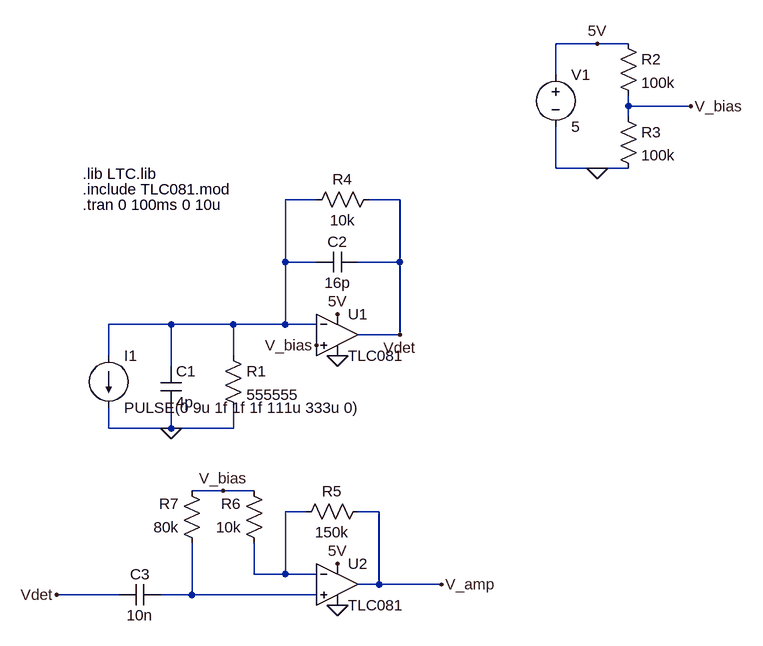
[diagram p0: schematic Draft1.asc]
Draft1.asc, the LTspice schematic file:
Version 4.1
SHEET 1 880 780
WIRE 640 -128 576 -128
WIRE 688 -128 640 -128
WIRE 576 -80 576 -128
WIRE 688 -32 688 -48
WIRE 784 -32 688 -32
WIRE 688 -16 688 -32
WIRE 576 64 576 0
WIRE 640 64 576 64
WIRE 688 64 640 64
WIRE 208 112 160 112
WIRE 336 112 288 112
WIRE 160 208 160 112
WIRE 208 208 160 208
WIRE 336 208 336 112
WIRE 336 208 272 208
WIRE -16 304 -112 304
WIRE 80 304 -16 304
WIRE 160 304 160 208
WIRE 160 304 80 304
WIRE 208 304 160 304
WIRE 336 320 336 208
WIRE 336 320 272 320
WIRE -112 352 -112 304
WIRE 80 352 80 304
WIRE -16 368 -16 304
WIRE -112 464 -112 432
WIRE -16 464 -16 432
WIRE -16 464 -112 464
WIRE 80 464 80 432
WIRE 80 464 -16 464
WIRE 64 560 16 560
WIRE 112 560 64 560
WIRE 192 592 160 592
WIRE 304 592 272 592
WIRE 112 688 112 640
WIRE 160 688 160 592
WIRE 160 688 112 688
WIRE 208 688 160 688
WIRE 304 704 304 592
WIRE 304 704 272 704
WIRE 400 704 304 704
WIRE -96 720 -192 720
WIRE 16 720 16 640
WIRE 16 720 -32 720
WIRE 208 720 16 720
FLAG -16 464 0
FLAG 640 64 0
FLAG 784 -32 V_bias
FLAG 640 -128 5V
FLAG 208 336 V_bias
FLAG 240 352 0
FLAG 240 288 5V
FLAG 336 320 Vdet
FLAG 240 736 0
FLAG 240 672 5V
FLAG 400 704 V_amp
FLAG -192 720 Vdet
FLAG 64 560 V_bias
SYMBOL current -112 352 R0
WINDOW 123 0 0 Left 0
WINDOW 39 0 0 Left 0
SYMATTR InstName I1
SYMATTR Value PULSE(0 9u 1f 1f 1f 111u 333u 0)
SYMBOL cap -32 368 R0
SYMATTR InstName C1
SYMATTR Value 4p
SYMBOL res 64 336 R0
SYMATTR InstName R1
SYMATTR Value 555555
SYMBOL OpAmps\\opamp2 240 256 R0
SYMATTR InstName U1
SYMATTR Value TLC081
SYMBOL voltage 576 -96 R0
SYMATTR InstName V1
SYMATTR Value 5
SYMBOL res 672 -144 R0
SYMATTR InstName R2
SYMATTR Value 100k
SYMBOL res 672 -32 R0
SYMATTR InstName R3
SYMATTR Value 100k
SYMBOL cap 272 192 R90
WINDOW 0 0 32 VBottom 2
WINDOW 3 32 32 VTop 2
SYMATTR InstName C2
SYMATTR Value 16p
SYMBOL res 304 96 R90
WINDOW 0 0 56 VBottom 2
WINDOW 3 32 56 VTop 2
SYMATTR InstName R4
SYMATTR Value 10k
SYMBOL OpAmps\\opamp2 240 640 R0
SYMATTR InstName U2
SYMATTR Value TLC081
SYMBOL res 288 576 R90
WINDOW 0 0 56 VBottom 2
WINDOW 3 32 56 VTop 2
SYMATTR InstName R5
SYMATTR Value 150k
SYMBOL res 128 656 R180
WINDOW 0 36 76 Left 2
WINDOW 3 36 40 Left 2
SYMATTR InstName R6
SYMATTR Value 10k
SYMBOL res 32 656 R180
WINDOW 0 36 76 Left 2
WINDOW 3 36 40 Left 2
SYMATTR InstName R7
SYMATTR Value 80k
SYMBOL cap -32 704 R90
WINDOW 0 0 32 VBottom 2
WINDOW 3 32 32 VTop 2
SYMATTR InstName C3
SYMATTR Value 10n
TEXT -152 72 Left 2 !.lib LTC.lib
TEXT -152 96 Left 2 !.include TLC081.mod
TEXT -152 120 Left 2 !.tran 0 100ms 0 10u

The netlist it stands for:
* Draft1.asc
I1 N001 0 PULSE(0 9u 1f 1f 1f 111u 333u 0)
C1 N001 0 4p
R1 N001 0 555555
X§U1 V_bias N001 5V 0 Vdet TLC081  ; pins In+ In- V+ V- OUT
V1 5V 0 5
R2 5V V_bias 100k
R3 V_bias 0 100k
C2 Vdet N001 16p
R4 Vdet N001 10k
X§U2 N003 N002 5V 0 V_amp TLC081  ; pins In+ In- V+ V- OUT
R5 V_amp N002 150k
R6 N002 V_bias 10k
R7 N003 V_bias 80k
C3 N003 Vdet 10n
.lib LTC.lib
.include TLC081.mod
.tran 0 100ms 0 10u
.backanno
.end